# EAGLE design HackmodWear_workingcopy3 (EAGLE 9.1.0)
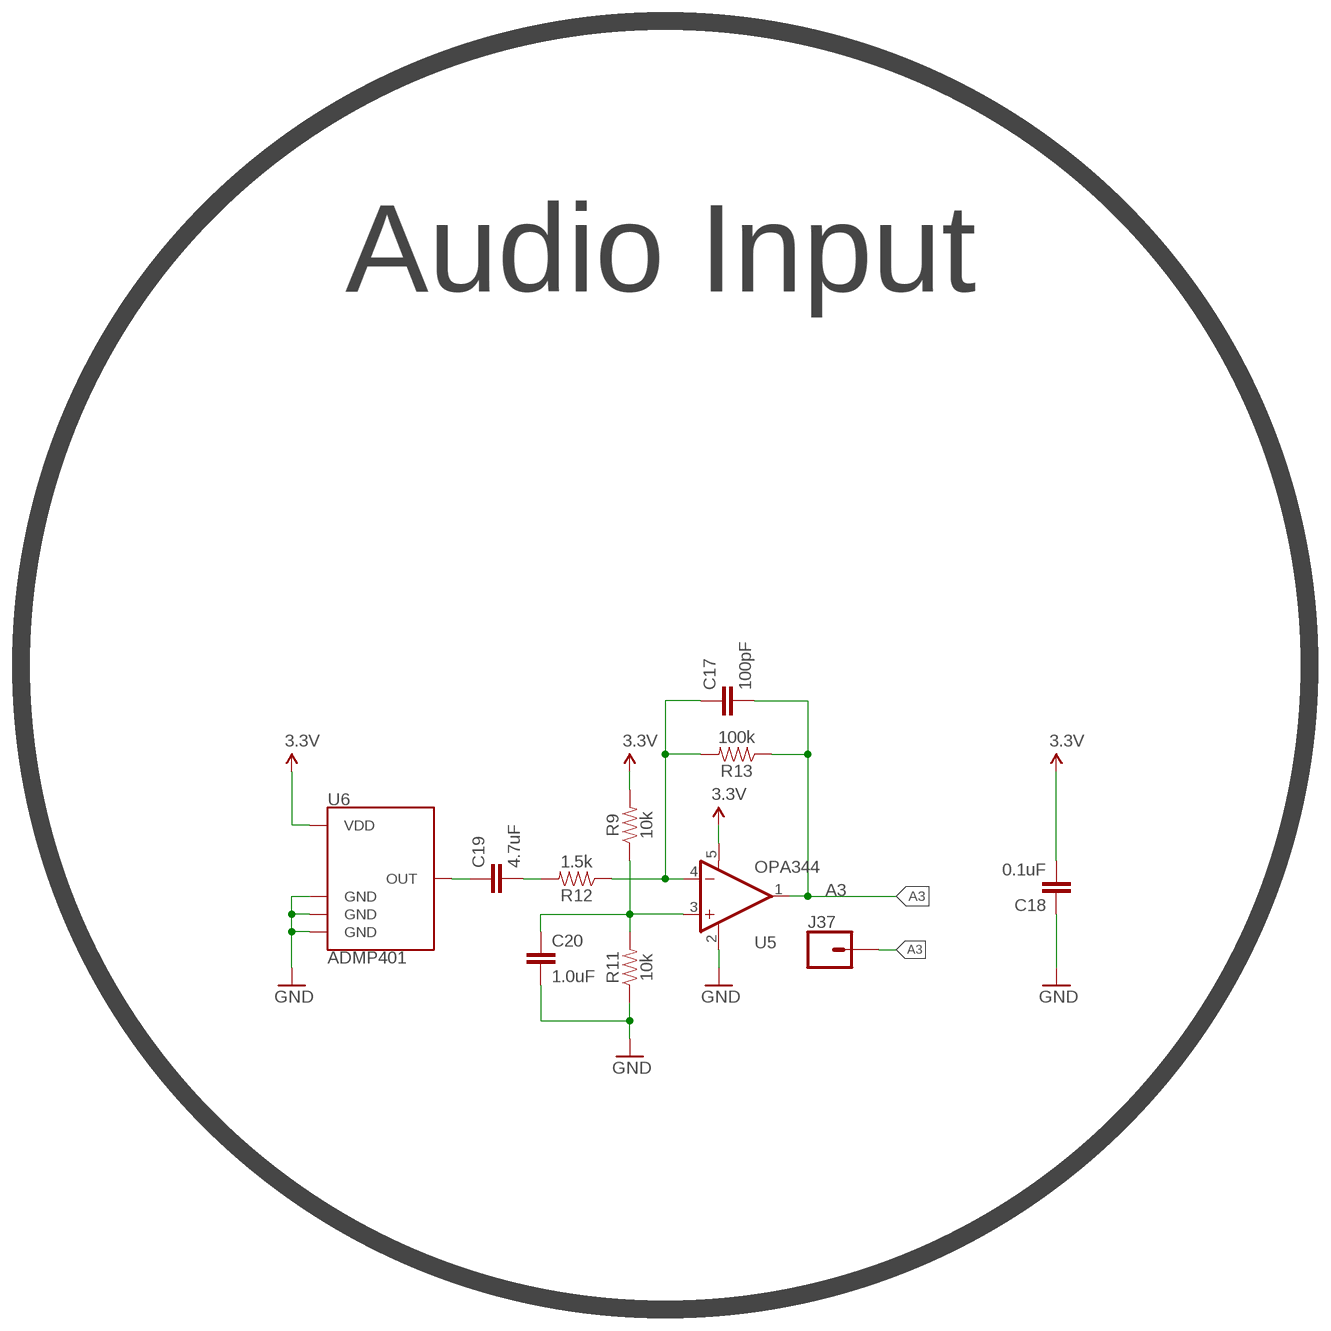
[diagram p0: schematic, sheet 1, part 1 of 3]
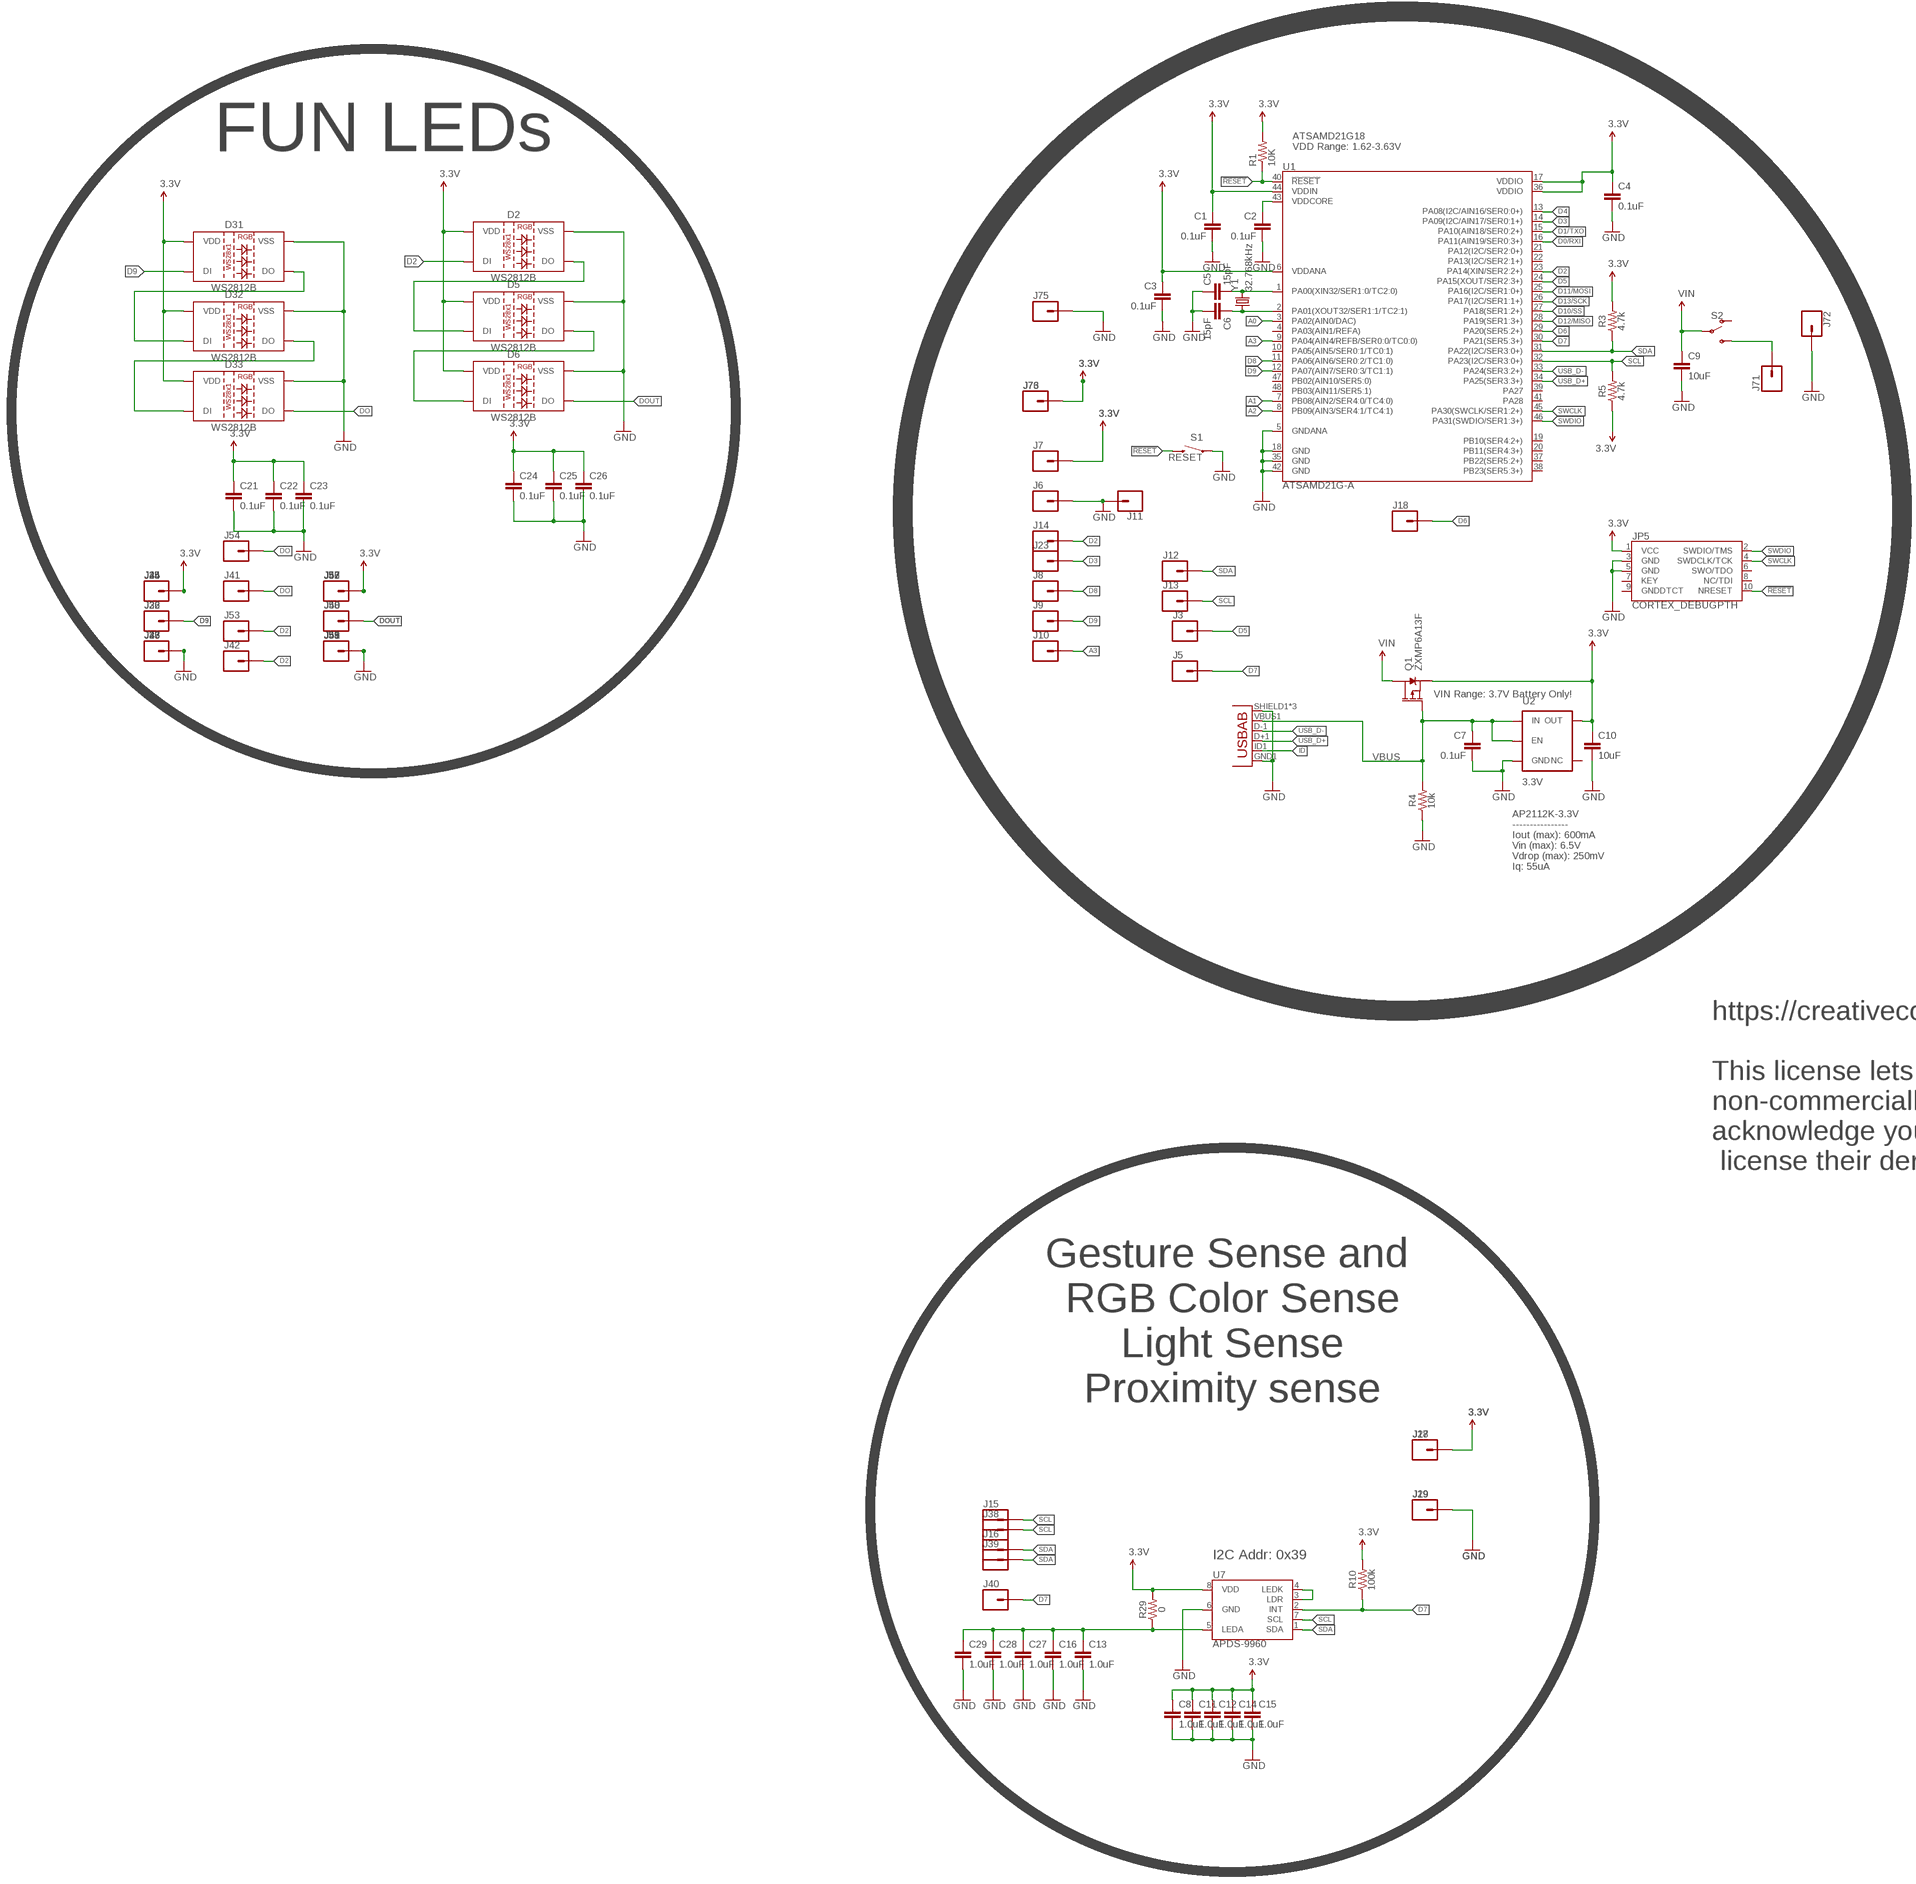
[diagram p1: schematic, sheet 1, part 2 of 3]
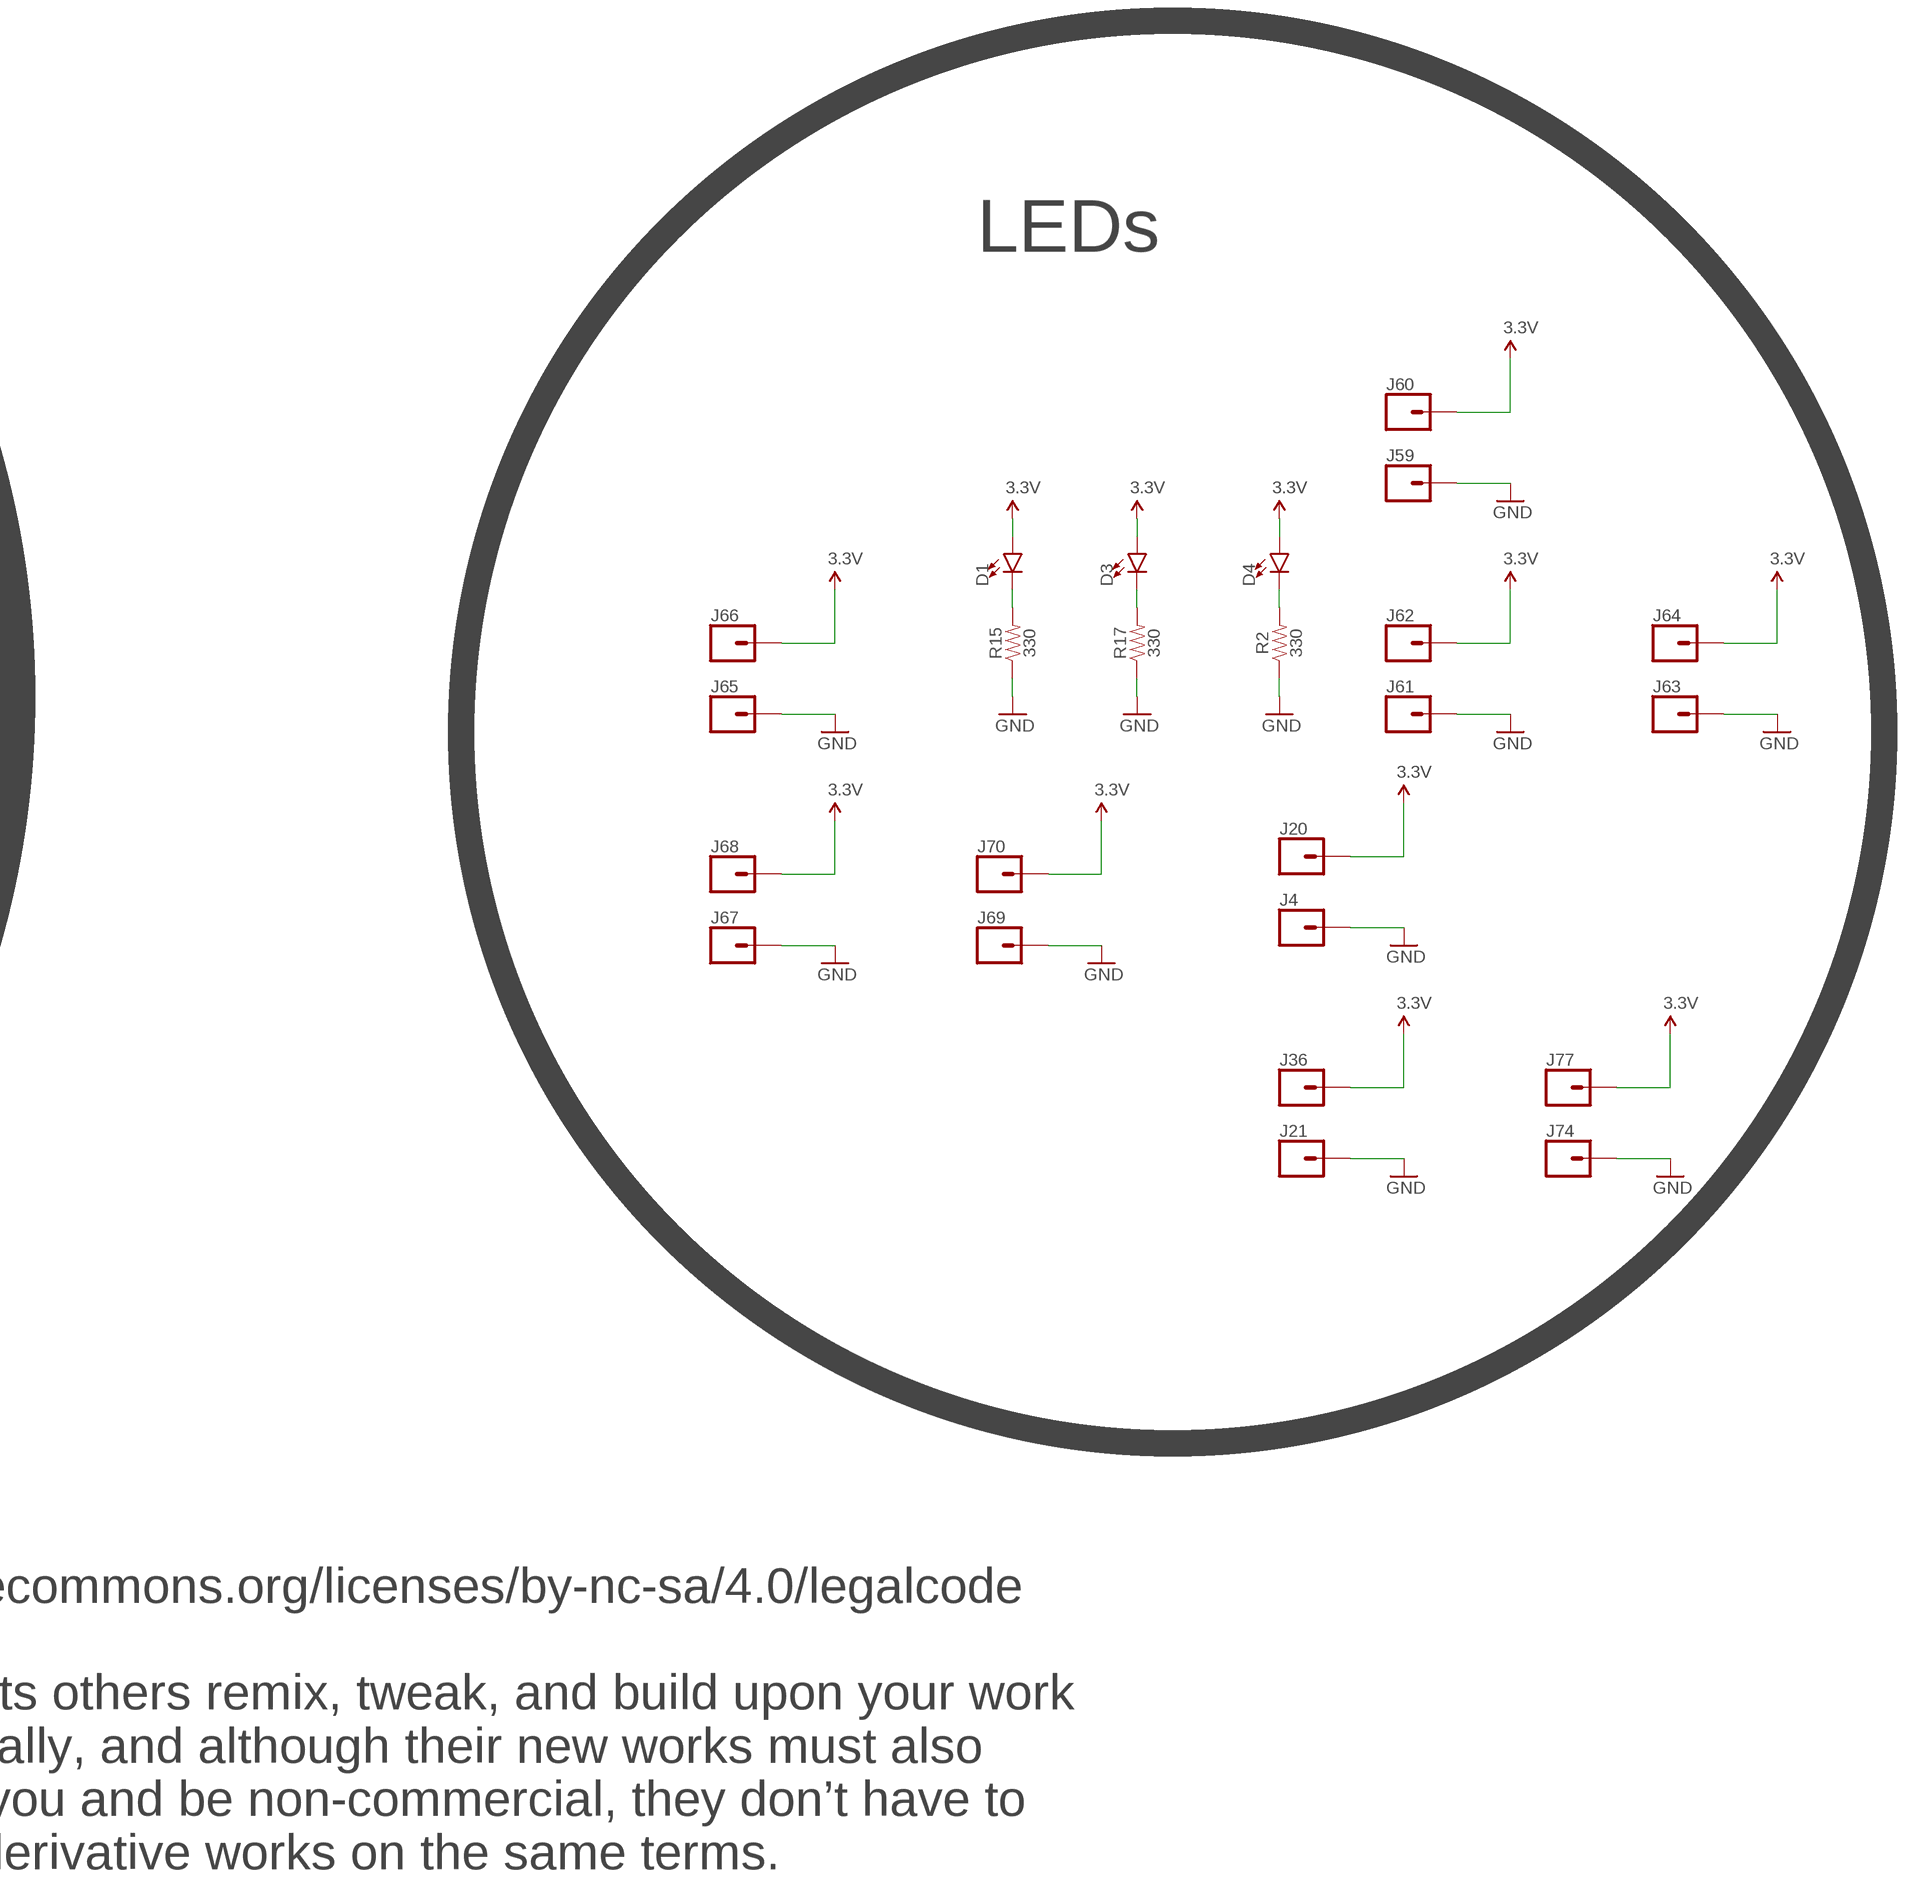
[diagram p2: schematic, sheet 1, part 3 of 3]

## Parts
C1  0.1uF  0.1UF-0603-25V-(+80/-20%)  [0603]
C2  0.1uF  0.1UF-0603-25V-(+80/-20%)  [0603]
C3  0.1uF  0.1UF-0603-25V-(+80/-20%)  [0603]
C4  0.1uF  0.1UF-0603-25V-(+80/-20%)  [0603]
C5  15pF  15PF-0603-50V-5%  [0603]
C6  15pF  15PF-0603-50V-5%  [0603]
C7  0.1uF  0.1UF-0603-25V-(+80/-20%)  [0603]
C8  1.0uF  1.0UF-0603-16V-10%  [0603]
C9  10uF  10UF-0603-6.3V-20%  [0603]
C10  10uF  10UF-0603-6.3V-20%  [0603]
C11  1.0uF  1.0UF-0603-16V-10%  [0603]
C12  1.0uF  1.0UF-0603-16V-10%  [0603]
C13  1.0uF  1.0UF-0603-16V-10%  [0603]
C14  1.0uF  1.0UF-0603-16V-10%  [0603]
C15  1.0uF  1.0UF-0603-16V-10%  [0603]
C16  1.0uF  1.0UF-0603-16V-10%  [0603]
C17  100pF  100PF-0603-50V-5%  [0603]
C18  0.1uF  0.1UF-0603-25V-(+80/-20%)  [0603]
C19  4.7uF  4.7UF0603  [0603]
C20  1.0uF  1.0UF-0603-16V-10%  [0603]
C21  0.1uF  0.1UF-0603-25V-(+80/-20%)  [0603]
C22  0.1uF  0.1UF-0603-25V-(+80/-20%)  [0603]
C23  0.1uF  0.1UF-0603-25V-(+80/-20%)  [0603]
C24  0.1uF  0.1UF-0603-25V-(+80/-20%)  [0603]
C25  0.1uF  0.1UF-0603-25V-(+80/-20%)  [0603]
C26  0.1uF  0.1UF-0603-25V-(+80/-20%)  [0603]
C27  1.0uF  1.0UF-0603-16V-10%  [0603]
C28  1.0uF  1.0UF-0603-16V-10%  [0603]
C29  1.0uF  1.0UF-0603-16V-10%  [0603]
D1  LED1206  [LED-1206]
D2  WS2812B  [WS2812B]
D3  LED1206  [LED-1206]
D4  LED1206  [LED-1206]
D5  WS2812B  [WS2812B]
D6  WS2812B  [WS2812B]
D31  WS2812B  [WS2812B]
D32  WS2812B  [WS2812B]
D33  WS2812B  [WS2812B]
J3  CONN_01  [1X01]
J4  CONN_01  [1X01]
J5  CONN_01  [1X01]
J6  CONN_01  [1X01]
J7  CONN_01  [1X01]
J8  CONN_01  [1X01]
J9  CONN_01  [1X01]
J10  CONN_01  [1X01]
J11  CONN_01  [1X01]
J12  CONN_01  [1X01]
J13  CONN_01  [1X01]
J14  CONN_01  [1X01]
J15  CONN_01  [1X01]
J16  CONN_01  [1X01]
J17  CONN_01  [1X01]
J18  CONN_01  [1X01]
J19  CONN_01  [1X01]
J20  CONN_01  [1X01]
J21  CONN_01  [1X01]
J23  CONN_01  [1X01]
J25  CONN_01  [1X01]
J26  CONN_01  [1X01]
J27  CONN_01  [1X01]
J28  CONN_01  [1X01]
J29  CONN_01  [1X01]
J32  CONN_01  [1X01]
J33  CONN_01  [1X01]
J34  CONN_01  [1X01]
J36  CONN_01  [1X01]
J37  CONN_01  [1X01]
J38  CONN_01  [1X01]
J39  CONN_01  [1X01]
J40  CONN_01  [1X01]
J41  CONN_01  [1X01]
J42  CONN_01  [1X01]
J43  CONN_01  [1X01]
J44  CONN_01  [1X01]
J45  CONN_01  [1X01]
J46  CONN_01  [1X01]
J47  CONN_01  [1X01]
J48  CONN_01  [1X01]
J49  CONN_01  [1X01]
J50  CONN_01  [1X01]
J51  CONN_01  [1X01]
J52  CONN_01  [1X01]
J53  CONN_01  [1X01]
J54  CONN_01  [1X01]
J55  CONN_01  [1X01]
J56  CONN_01  [1X01]
J57  CONN_01  [1X01]
J58  CONN_01  [1X01]
J59  CONN_01  [1X01]
J60  CONN_01  [1X01]
J61  CONN_01  [1X01]
J62  CONN_01  [1X01]
J63  CONN_01  [1X01]
J64  CONN_01  [1X01]
J65  CONN_01  [1X01]
J66  CONN_01  [1X01]
J67  CONN_01  [1X01]
J68  CONN_01  [1X01]
J69  CONN_01  [1X01]
J70  CONN_01  [1X01]
J71  CONN_01  [1X01]
J72  CONN_01  [1X01]
J73  CONN_01  [1X01]
J74  CONN_01  [1X01]
J75  CONN_01  [1X01]
J76  CONN_01  [1X01]
J77  CONN_01  [1X01]
JP3  USB-ABCONN-11794  [USB-AB-MICRO-SMD_V03]
JP5  CORTEX_DEBUGPTH  [2X5-PTH-1.27MM]
Q1  ZXMP6A13F  MOSFET_PCH-SI2309DS  [SOT23-3]
R1  10K  10KOHM-1/10W-1%(0603)0603  [0603-RES@1]
R2  330  330OHM-0603-1/10W-1%  [0603]
R3  4.7k  4.7KOHM-0603-1/10W-1%  [0603]
R4  10k  10KOHM-0603-1/10W-1%  [0603]
R5  4.7k  4.7KOHM-0603-1/10W-1%  [0603]
R9  10k  10KOHM-0603-1/10W-1%  [0603]
R10  100k  100KOHM-0603-1/10W-1%  [0603]
R11  10k  10KOHM-0603-1/10W-1%  [0603]
R12  1.5k  1.5KOHM-0603-1/10W-1%  [0603]
R13  100k  100KOHM-0603-1/10W-1%  [0603]
R15  330  330OHM-0603-1/10W-1%  [0603]
R17  330  330OHM-0603-1/10W-1%  [0603]
R29  0  0OHM-0603-1/10W-5%  [0603]
S1  RESET  SWITCH-MOMENTARY-2SMD-4.6X2.8MM  [TACTILE_SWITCH_SMD_4.6X2.8MM]
S2  SWITCH-SPDT-SMD-RIGHT-ANGLE  [SWITCH_SPST_SMD_A]
U1  ATSAMD21G-A  [TQFP-48]
U2  3.3V  V_REG_AP2112K-3.3V  [SOT23-5]
U5  OPA344  [SOT23-5]
U6  ADMP401  [ADMP401]
U7  APDS-9960  [APDS-9960]
Y1  32.768kHz  CRYSTAL3.2X1.5MM  [CRYSTAL-SMD-3.2X1.5MM]

## Nets
3.3V: C1.1 C4.1 C8.1 C10.1 C11.1 C12.1 C14.1 C15.1 C18.2 C21.1 C22.1 C23.1 C24.1 C25.1 C26.1 D1.A D2.1(VDD) D3.A D4.A D5.1(VDD) D6.1(VDD) D31.1(VDD) D32.1(VDD) D33.1(VDD) J7.P$1 J17.P$1 J20.P$1 J25.P$1 J28.P$1 J34.P$1 J36.P$1 J44.P$1 J45.P$1 J47.P$1 J52.P$1 J56.P$1 J57.P$1 J60.P$1 J62.P$1 J64.P$1 J66.P$1 J68.P$1 J70.P$1 J73.P$1 J76.P$1 J77.P$1 JP5.1(VCC) Q1.2(S) R1.2 R3.2 R5.1 R9.2 R10.2 R29.2 U1.17(VDDIO) U1.36(VDDIO) U1.44(VDDIN) U2.5(OUT) U5.5(V+) U6.5(VDD) U7.8(VDD)
!RESET: JP5.10(NRESET) R1.1 S1.3 S1.4 U1.40(!RESET!)
A0: U1.3(PA02(AIN0/DAC))
A1: U1.7(PB08(AIN2/SER4:0/TC4:0))
A2: U1.8(PB09(AIN3/SER4:1/TC4:1))
A3: C17.2 J10.P$1 J37.P$1 R13.1 U1.9(PA04(AIN4/REFB/SER0:0/TC0:0)) U5.1(OUT)
D0/RXI: U1.16(PA11(AIN19/SER0:3+))
D1/TXO: U1.15(PA10(AIN18/SER0:2+))
D2: D2.4(DI) J14.P$1 J42.P$1 J53.P$1 U1.23(PA14(XIN/SER2:2+))
D3: J23.P$1 U1.14(PA09(I2C/AIN17/SER0:1+))
D4: U1.13(PA08(I2C/AIN16/SER0:0+))
D5: J3.P$1 U1.24(PA15(XOUT/SER2:3+))
D6: J18.P$1 U1.29(PA20(SER5:2+))
D7: J5.P$1 J40.P$1 R10.1 U1.30(PA21(SER5:3+)) U7.2(INT)
D8: J8.P$1 U1.11(PA06(AIN6/SER0:2/TC1:0))
D9: D31.4(DI) J9.P$1 J26.P$1 J32.P$1 U1.12(PA07(AIN7/SER0:3/TC1:1))
D10/SS: U1.27(PA18(SER1:2+))
D11/MOSI: U1.25(PA16(I2C/SER1:0+))
D12/MISO: U1.28(PA19(SER1:3+))
D13/SCK: U1.26(PA17(I2C/SER1:1+))
DO: D33.2(DO) J41.P$1 J54.P$1
DOUT: D6.2(DO) J48.P$1 J50.P$1
GND: C1.2 C2.2 C3.2 C4.2 C5.1 C6.2 C7.2 C8.2 C9.2 C10.2 C11.2 C12.2 C13.2 C14.2 C15.2 C16.2 C18.1 C20.2 C21.2 C22.2 C23.2 C24.2 C25.2 C26.2 C27.2 C28.2 C29.2 D2.3(VSS) D5.3(VSS) D6.3(VSS) D31.3(VSS) D32.3(VSS) D33.3(VSS) J4.P$1 J6.P$1 J11.P$1 J19.P$1 J21.P$1 J27.P$1 J29.P$1 J33.P$1 J43.P$1 J46.P$1 J49.P$1 J51.P$1 J55.P$1 J58.P$1 J59.P$1 J61.P$1 J63.P$1 J65.P$1 J67.P$1 J69.P$1 J72.P$1 J74.P$1 J75.P$1 JP3.GND1(GND) JP3.SHIELD1(SHIELD) JP3.SHIELD2(SHIELD) JP3.SHIELD3(SHIELD) JP5.3(GND) JP5.5(GND) R2.1 R4.1 R11.1 R15.1 R17.1 S1.1 S1.2 U1.5(GNDANA) U1.18(GND) U1.35(GND) U1.42(GND) U2.2(GND) U5.2(V-) U6.2(GND) U6.4(GND) U6.6(GND) U7.6(GND)
ID: JP3.ID1(USBID)
LEDA: C13.1 C16.1 C27.1 C28.1 C29.1 R29.1 U7.5(LEDA)
N$1: D4.C R2.2
N$2: C5.2 U1.1(PA00(XIN32/SER1:0/TC2:0)) Y1.P$2
N$3: C19.1 U6.1(OUT)
N$4: C6.1 U1.2(PA01(XOUT32/SER1:1/TC2:1)) Y1.P$1
N$5: U7.3(LDR) U7.4(LEDK)
N$6: C17.1 R12.1 R13.2 U5.4(-IN)
N$10: C19.2 R12.2
N$11: C20.1 R9.1 R11.2 U5.3(+IN)
N$12: D1.C R15.2
N$14: D31.2(DO) D32.4(DI)
N$15: D3.C R17.2
N$16: D32.2(DO) D33.4(DI)
N$21: J71.P$1 S2.3(S)
N$22: D2.2(DO) D5.4(DI)
N$23: D5.2(DO) D6.4(DI)
SCL: J13.P$1 J15.P$1 J38.P$1 R5.2 U1.32(PA23(I2C/SER3:0+)) U7.7(SCL)
SDA: J12.P$1 J16.P$1 J39.P$1 R3.1 U1.31(PA22(I2C/SER3:0+)) U7.1(SDA)
SWCLK: JP5.4(SWDCLK/TCK) U1.45(PA30(SWCLK/SER1:2+))
SWDIO: JP5.2(SWDIO/TMS) U1.46(PA31(SWDIO/SER1:3+))
USB_D+: JP3.D+1(D+) U1.34(PA25(SER3:3+))
USB_D-: JP3.D-1(D-) U1.33(PA24(SER3:2+))
VBUS: C7.1 JP3.VBUS1(VBUS) Q1.1(G) R4.2 U2.1(IN) U2.3(EN)
VDDANA: C3.1 U1.6(VDDANA) ; supply symbol labelled 3.3V
VDDCORE: C2.1 U1.43(VDDCORE)
VIN: C9.1 Q1.3(D) S2.2(P)
Unconnected: JP5.6(SWO/TDO) JP5.7(KEY) JP5.8(NC/TDI) JP5.9(GNDDTCT) S2.1(O) U1.4(PA03(AIN1/REFA)) U1.10(PA05(AIN5/SER0:1/TC0:1)) U1.19(PB10(SER4:2+)) U1.20(PB11(SER4:3+)) U1.21(PA12(I2C/SER2:0+)) U1.22(PA13(I2C/SER2:1+)) U1.37(PB22(SER5:2+)) U1.38(PB23(SER5:3+)) U1.39(PA27) U1.41(PA28) U1.47(PB02(AIN10/SER5:0)) U1.48(PB03(AIN11/SER5:1)) U2.4(NC)

## Notes on the sheet
- Audio Input
- ATSAMD21G18
  VDD Range: 1.62-3.63V
- FUN LEDs
- LEDs
- VIN Range: 3.7V Battery Only!
- AP2112K-3.3V
  ----------------
  Iout (max): 600mA 
  Vin (max): 6.5V
  Vdrop (max): 250mV
  Iq: 55uA
- https://creativecommons.org/licenses/by-nc-sa/4.0/legalcode
  
  This license lets others remix, tweak, and build upon your work
  non-commercially, and although their new works must also 
  acknowledge you and be non-commercial, they don’t have to
   license their derivative works on the same terms.
- Gesture Sense and 
  RGB Color Sense
  Light Sense
  Proximity sense
- I2C Addr: 0x39

## Library data of the parts
C1-C4 C7 C18 C21-C26 = SparkFun-Capacitors:0.1UF: 0.1µF ceramic capacitors A capacitor is a passive two-terminal electrical component used to store electrical energy temporarily in an electric field.; PROD_ID: CAP-00810
C5 C6 = SparkFun-Capacitors:15PF: 15pF ceramic capacitors A capacitor is a passive two-terminal electrical component used to store electrical energy temporarily in an electric field.; PROD_ID: CAP-07881
C8 C11-C16 C20 C27-C29 = SparkFun-Capacitors:1.0UF: 1µF ceramic capacitors A capacitor is a passive two-terminal electrical component used to store electrical energy temporarily in an electric field.; PROD_ID: CAP-00868
C9 C10 = SparkFun-Capacitors:10UF: 10.0µF ceramic capacitors A capacitor is a passive two-terminal electrical component used to store electrical energy temporarily in an electric field.; PROD_ID: CAP-11015
C17 = SparkFun-Capacitors:100PF: 100pF/0.1nF ceramic capacitors A capacitor is a passive two-terminal electrical component used to store electrical energy temporarily in an electric field.; PROD_ID: CAP-07883
C19 = SparkFun-Capacitors:4.7UF: 4.7µF ceramic capacitors A capacitor is a passive two-terminal electrical component used to store electrical energy temporarily in an electric field.; PROD_ID: CAP-08280
D1 D3 D4 = SparkFun-LED:LED: LED (Generic) Standard schematic elements and footprints for 5mm, 3mm, 1206, and 0603 sized LEDs. Generic LEDs with no color specified.
D2 D5 D6 D31-D33 = SparkFun-LED:WS2812B: WS2812B SMD addressable RGB LED 5x5mm SMD LED with built-in controller IC. Color: Red/Green/Blue mC Rating: RGB: 390, 660, 180 mcd Forward Voltage: RGB: 2.0, 3.0, 3.0 V Packages:WS2812B SparkFun Products: Blynk Board - ESP8266 <https://www.sparkfun.com/products/13794>; PROD_ID: DIO-12503
J3-J21 J23 J25-J29 J32-J34 J36-J77 = SparkFun-Connectors:CONN_01: Single connection point. Often used as Generic Header-pin footprint for 0.1 inch spaced/style header connections On any of the 0.1 inch spaced packages, you can populate with these: Break Away Headers - Straight (PRT-00116) Break Away Male Headers - Right Angle (PRT-00553) Female Headers (PRT-00115) Break Away Headers - Machine Pin (PRT-00117) Break Away Female Headers - Swiss Machine Pin (PRT-00743) This device is also useful as a general connection point to wire up your design to another part of your project. Our various solder wires solder well into these plated through hole pads. Hook-Up Wire - Assortment (Stranded, 22 AWG) (PRT-11375) Hook-Up Wire - Assortment (Solid Core, 22 AWG) (PRT-11367) View the entire wire category on our website here Special notes: SMTSO-256-ET is a "flush mount" nut for a 4-40 screw. We mostly use this on specialty testbeds; it is a nice way to connect hardware to your PCB at an adjustable hieght. Also note, the SNAP packages are for using a snappable style connector. We sell a baggie of snaps and they are also used on two LilyPad designs: Snap Assortment - 30 pack (male and female) (DEV-11347) LilyPad Arduino SimpleSnap (DEV-10941) LilyPad SimpleSnap Protoboard (DEV-10940)
JP3 = SparkFun-Connectors:USB-AB: This is a USB AB connector that is compatible with USB OTG. i.e. this connector can serve as a host or device; PROD_ID: CONN-11794
JP5 = samd21-temp:CORTEX_DEBUG: Cortex Debug Connector Datasheet
Q1 = SparkFun-DiscreteSemi:MOSFET_PCH: P-channel MOSFETs Voltage controlled devices that allow control of high current outputs. SparkFun Products: SparkFun ESP32 Thing <https://www.sparkfun.com/products/13907> SparkFun ESP8266 Thing <https://www.sparkfun.com/products/13231>; PROD_ID: TRANS-08285; VALUE: 1.1A/60V/600mΩ
R1 = SparkFun-Resistors:10KOHM-1/10W-1%(0603): RES-00824; PROD_ID: RES-00824
R2 R15 R17 = SparkFun-Resistors:330OHM: 330Ω resistor A resistor is a passive two-terminal electrical component that implements electrical resistance as a circuit element. Resistors act to reduce current flow, and, at the same time, act to lower voltage levels within circuits. - Wikipedia; PROD_ID: RES-00818
R3 R5 = SparkFun-Resistors:4.7KOHM: 4.7kΩ resistor A resistor is a passive two-terminal electrical component that implements electrical resistance as a circuit element. Resistors act to reduce current flow, and, at the same time, act to lower voltage levels within circuits. - Wikipedia; PROD_ID: RES-07857
R4 R9 R11 = SparkFun-Resistors:10KOHM: 10kΩ resistor A resistor is a passive two-terminal electrical component that implements electrical resistance as a circuit element. Resistors act to reduce current flow, and, at the same time, act to lower voltage levels within circuits. - Wikipedia; PROD_ID: RES-00824
R10 R13 = SparkFun-Resistors:100KOHM: 100kΩ resistor A resistor is a passive two-terminal electrical component that implements electrical resistance as a circuit element. Resistors act to reduce current flow, and, at the same time, act to lower voltage levels within circuits. - Wikipedia; PROD_ID: RES-07828
R12 = SparkFun-Resistors:1.5KOHM: 1.5kΩ resistor A resistor is a passive two-terminal electrical component that implements electrical resistance as a circuit element. Resistors act to reduce current flow, and, at the same time, act to lower voltage levels within circuits. - Wikipedia; PROD_ID: RES-08306
R29 = SparkFun-Resistors:0OHM: 0Ω resistor A resistor is a passive two-terminal electrical component that implements electrical resistance as a circuit element. Resistors act to reduce current flow, and, at the same time, act to lower voltage levels within circuits. - Wikipedia; PROD_ID: RES-08609
S1 = samd21-temp:SWITCH-MOMENTARY-2: Various NO switches- pushbuttons, reed, etc; PROD_ID: SWCH-13065
S2 = SparkFun-Switches:SWITCH-SPDT: Single Pole, Double Throw (SPDT) Switch Single-pole, double-throw (SPDT) switch. Variant Overview SMD-AYZ0202 Surface Mount DPDT Switch (COM-00597) Used on e.g. LilyPad Arduino USB - ATmega32U4 Board PTH-11.6X4.0MM SPDT Mini Power Switch (COM-00102) Used on e.g. SparkFun Simon Says - Through-Hole Soldering Kit (KIT-10547) PTH-11.6X4.0MM-KIT KIT version of SPDT Mini Power Switch - Simplifies soldering by removing tStop of switch pins - only one side can be soldered. PTH-11.6X4.0MM-LOCK LOCK version of SPDT Mini Power Switch - Offset pins hold switch in place for easier soldering. SMD-RIGHT-ANGLE Surface Mount Right Angle Switch (COM-10860) Used on e.g. SparkFun ESP8266 Thing; PROD_ID: SWCH-10651; SF_SKU: COM-10860
U1 = samd21-temp:ATSAMD21G: Atmel SAMD21G SMART ARM-Based Microcontroller The Atmel ® | SMART ™ SAM D21 is a series of low-power microcontrollers using the 32-bit ARM ® Cortex ® -M0+ processor, and ranging from 32- to 64-pins with up to 256KB Flash and 32KB of SRAM. The SAM D21 devices operate at a maximum frequency of 48MHz and reach 2.46 CoreMark/MHz. They are designed for simple and intuitive migration with identical peripheral modules, hex compatible code, identical linear address map and pin compatible migration paths between all devices in the product series. All devices include intelligent and flexible peripherals, Atmel Event System for inter-peripheral signaling, and support for capacitive touch button, slider and wheel user interfaces.; PROD_ID: IC-13064
U2 = SparkFun-PowerIC:V_REG_AP2112: AP2112 - 600mA CMOS LDO Regulator w/ Enable The AP2112 is CMOS process low dropout linear regulator with enable function, the regulator delivers a guaranteed 600mA (min.) continuous load current. Features Output Voltage Accuracy: ±1.5% Output Current: 600mA (Min.) Foldback Short Current Protection: 50mA Enable Function to Turn ON/OFF VOUT Low Dropout Voltage (3.3V): 250mV (Typ.) @IOUT=600mA Excellent Load Regulation: 0.2%/A (Typ.) Excellent Line Regulation: 0.02%/V (Typ.) Low Quiescent Current: 55μA (Typ.) Low Standby Current: 0.01μA (Typ.) Low Output Noise: 50μVRMS PSRR: 100Hz -65dB, 1kHz -65dB OTSD Protection Stable with 1.0μF Flexible Cap: Ceramic, Tantalum and Aluminum Electrolytic Operation Temperature Range: -40°C to 85°C ESD: MM 400V, HBM 4000V; PROD_ID: VREG-12457
U5 = SparkFun:OPA344
U6 = SparkFun-Sensors:ADMP401: ADMP401 - Omnidirection Bottom-Port MEMS Microphone The ADMP401 is a high quality, low cost, low power analog output bottom-ported omnidirectional MEMS microphone. The ADMP401 consists of a MEMS microphone element, an impedance converter, and an output amplifier. The ADMP401 sensitivity specification makes it an excellent choice for both near field and far field applications. Datasheet SparkFun Products SparkFun MEMS Microphone Breakout - INMP401 (ADMP401) (BOB-09868) MEMS Microphone - INMP401 (ADMP401) (COM-10028); PROD_ID: IC-09773
U7 = SparkFun-Sensors:APDS-9960: Avago APDS-9960 Digital Proximity, Ambient Light, RGB, and Gesture Sensor. The APDS-9960 offers ambient light and color measuring, proximity detection, and touchless gesture sensing. It features UV and IR blocking filters, four separate diodes sensitive to different directions, and an I2C compatible interface. Datasheet SparkFun Products SparkFun RGB and Gesture Sensor - APDS-9960 (SEN-12787); PROD_ID: SEN-12005
Y1 = samd21-temp:CRYSTAL: Various standard crystals. Proven footprints.; PROD_ID: XTAL-13062

## Board
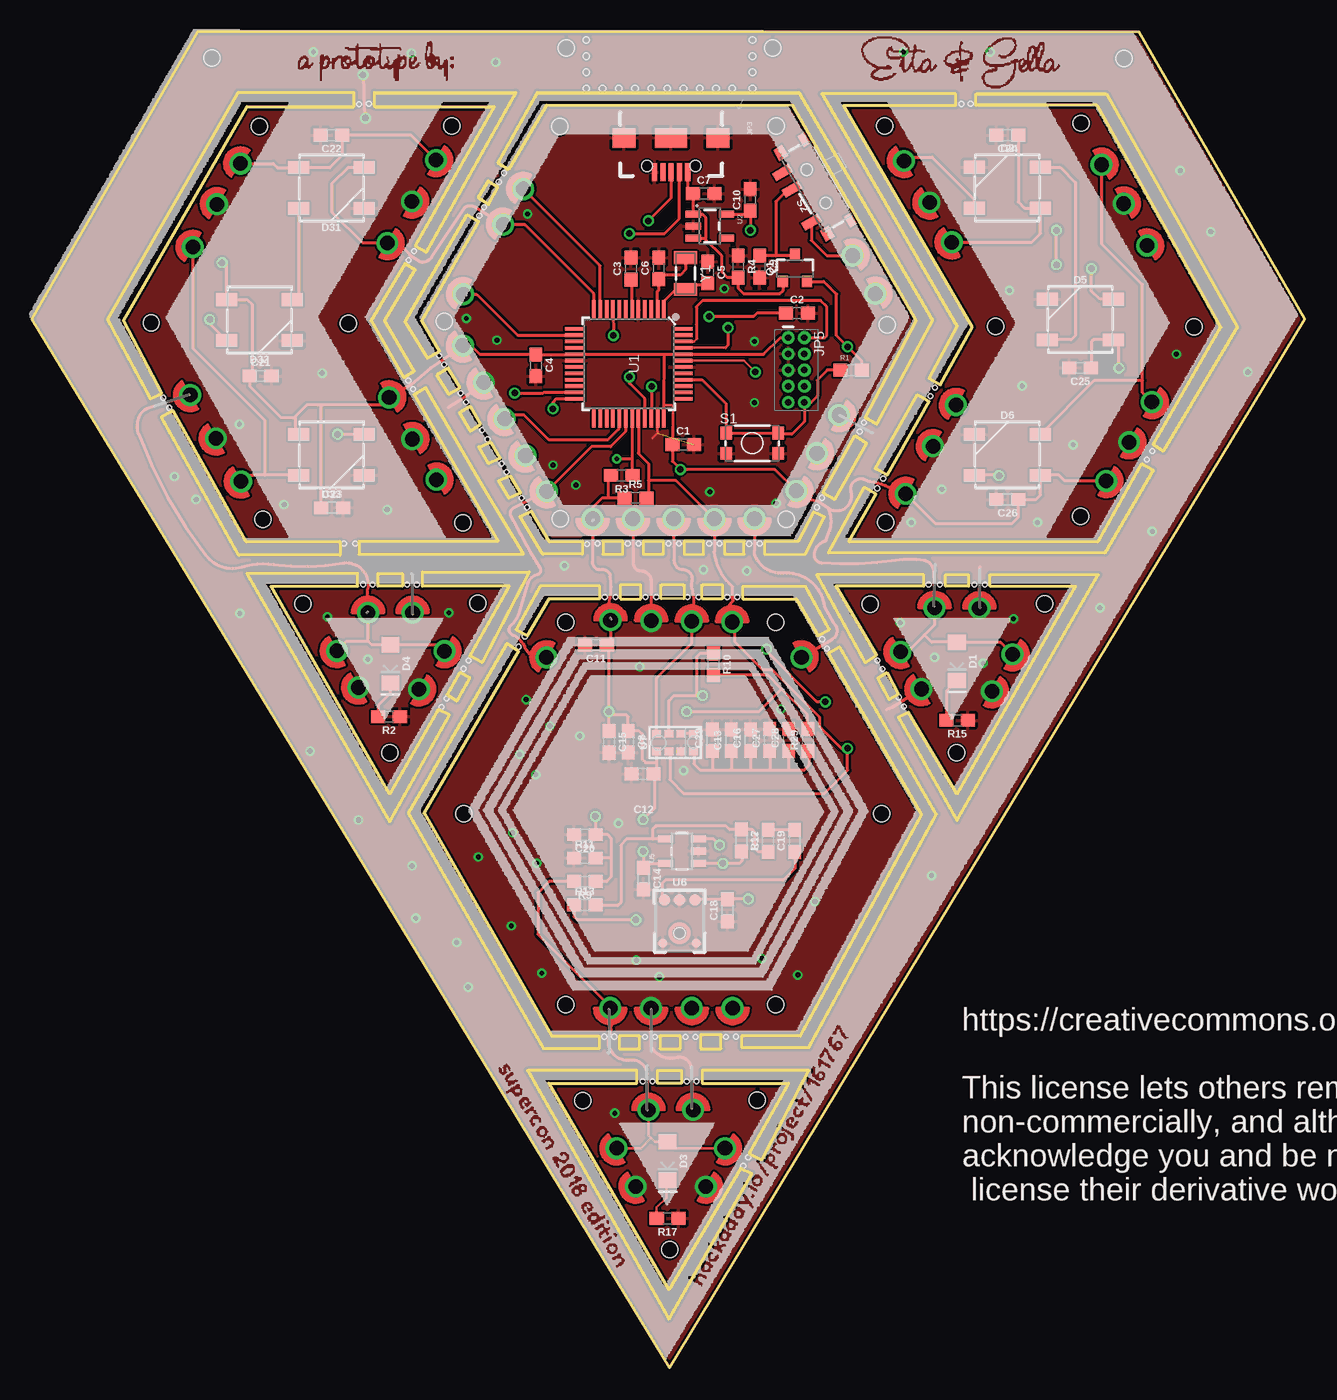
[diagram p3: board, top side]
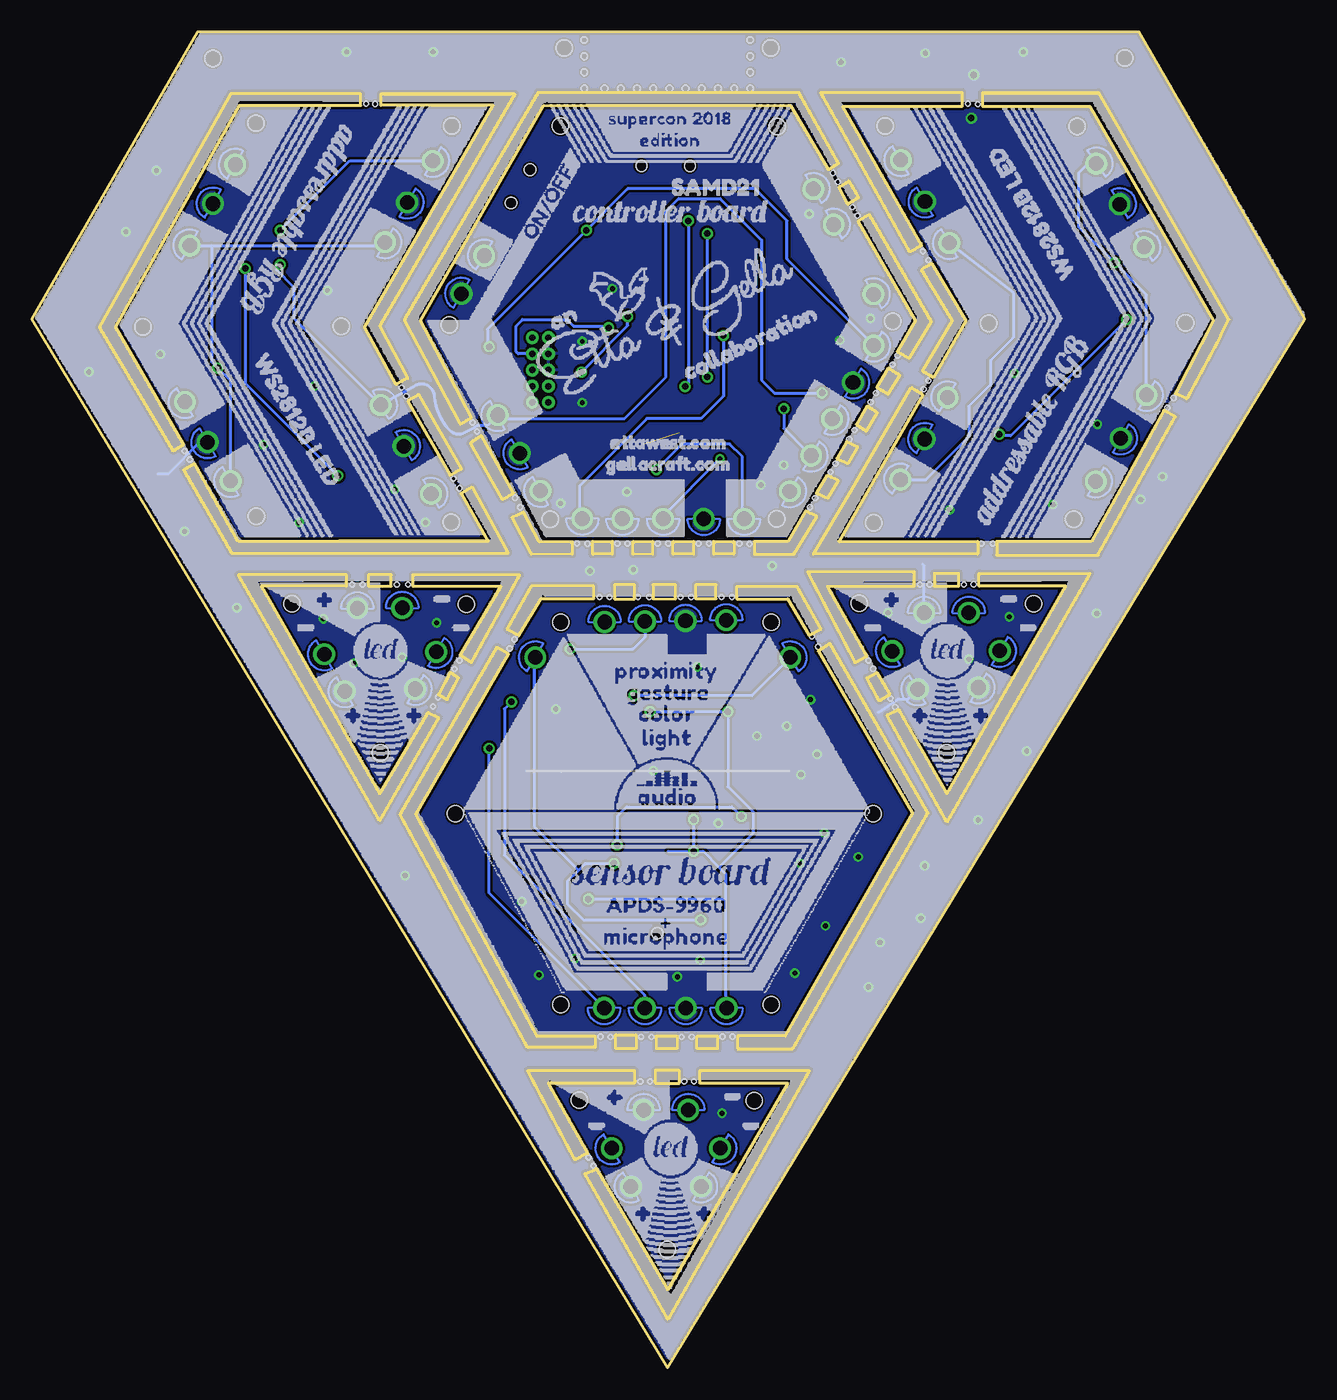
[diagram p4: board, bottom side, seen from below]

Size 99.85 x 104.77 mm. Coordinates in mm from the lower left corner, seen from the top.
Outline: 251 segments
Copper layers (1*16): Top 0.035mm / dielectric 1.5mm / Bottom 0.035mm
Design rules "SparkFun-2-layer-TIGHT": minimum track width 7mil, minimum drill 15mil, track to track 7mil, track to pad 7mil, pad to pad 7mil, via to via 7mil, smd to smd 7mil, copper to edge 7mil, drill to drill 7mil, minimum pad ring 7mil, minimum via ring 7mil, stop-mask expansion 4mil, vias tented up to drill 25mil, thermal gap 10mil
Holes 1.27 mm at 33.82,66.28 32.93,97.39 41.87,28.46 66.65,43.43 59.18,66.54 21.27,59.91 28.09,48.22 41.91,103.5 58.37,28.46 34.97,59.95 85.66,102.68 66.91,97.38 66.97,66.32 82.3,97.61 41.87,58.46 58.37,58.46 41.45,66.56 32.35,82.06 41.39,97.37 9.36,81.96 17.86,97.37 18.12,66.53 75.59,81.68 82.25,66.77 58.1,103.5 24.81,81.9 14.12,102.72 33.87,43.46 58.39,97.39 67.1,81.81 91.16,81.62 65.76,59.89 72.53,48.23 79.46,59.93 43.21,20.93 50.03,9.24 56.91,20.97
Holes 0.51 mm at 43.5,100.33 43.5,101.6 43.5,102.87 43.5,104.14 56.52,100.33 56.52,101.6 56.52,102.87 56.52,104.14 48.58,100.33 47.31,100.33 46.04,100.33 44.77,100.33 53.66,100.33 52.39,100.33 51.12,100.33 49.85,100.33 54.93,100.33
Holes 0.38 mm at 25.66,99.11 26.44,99.13 29.54,86.87 29.97,87.58 29.53,77.42 29.9,76.75 31.94,79.38 32.34,78.68 33.64,76.44 34.06,75.72 35.74,72.82 35.32,73.55 36.83,70.92 37.22,70.24 38.41,68.2 38.83,67.49 43.55,64.61 44.37,64.64 46.74,64.64 47.58,64.64 49.94,64.65 50.76,64.64 53.13,64.64 53.93,64.64 56.27,64.62 57.09,64.63 61.99,57.13 62.37,56.4 55.32,60.45 54.54,60.44 52.31,60.44 51.42,60.44 48.97,60.44 48.14,60.44 45.77,60.46 44.93,60.44 25.98,61.44 25.37,64.63 24.47,64.64 26.74,61.43 29.43,61.43 30.2,61.44 38.66,57.36 38.17,56.55 87.87,71.91 87.46,71.22 70.84,76.86 65.27,74.13 70.47,76.21 66.78,69.74 66.31,68.97 35.09,90.36 35.48,91.02 36.63,93.01 37.03,93.71 64.93,73.42 61.57,67.48 61.96,68.23 34.25,55.47 33.86,54.81 32.52,52.48 32.14,51.82 70.35,61.41 71.23,61.41 73.92,61.41 74.75,61.44 68.39,51.86 67.99,52.58 66.7,54.8 66.32,55.46 47.92,22.46 48.68,22.45 51.37,22.45 52.14,22.46 56.19,16.49 55.8,15.83 55.23,25.96 54.45,25.95 52.07,25.96 51.26,25.96 48.88,25.95 48.1,25.95 45.68,25.97 44.9,25.96 72.92,99.12 73.64,99.13 10.3,76.07 10.78,75.28

### Footprints (pad centres in the part's own frame; a part is rotated, then mirrored left to right if it is on the bottom)
0603 = smd 1.1 x 1: 1 -0.85,0; 2 0.85,0
LED-1206 = smd 1.2 x 1.4: A -1.5,0; C 1.5,0
WS2812B = smd 1.651 x 1: 1 2.577,-1.6; 2 2.577,1.6; 3 -2.577,1.6; 4 -2.577,-1.6
1X01 = drill 1.143: P$1 0,0
USB-AB-MICRO-SMD_V03 = smd 1.4 x 0.4: D+1 2.7,0; D-1 2.7,0.65; GND1 2.7,-1.3; ID1 2.7,-0.65; VBUS1 2.7,1.3 | smd 1.5 x 1.8: SHIELD1 0,3.68; SHIELD3 0,-3.68 | smd 1.5 x 2.5: SHIELD2 0,0 | hole 0.85: 2.2,1.9; 2.2,-1.9
2X5-PTH-1.27MM = drill 0.508 pad 1: 1 -2.54,-0.635; 2 -2.54,0.635; 3 -1.27,-0.635; 4 -1.27,0.635; 5 0,-0.635; 6 0,0.635; 7 1.27,-0.635; 8 1.27,0.635; 9 2.54,-0.635; 10 2.54,0.635
SOT23-3 = smd 0.8 x 0.9: 1 -0.95,-1; 2 0.95,-1; 3 0,1.1
0603-RES@1 = smd 1.1 x 1: 1 -0.85,0; 2 0.85,0
TACTILE_SWITCH_SMD_4.6X2.8MM = smd 0.9 x 1: 1 -2.05,-0.8; 2 2.05,-0.8; 3 2.05,0.8; 4 -2.05,0.8
SWITCH_SPST_SMD_A = smd 0.7 x 1.5: 1 -2.25,-1.75; 2 -0.75,-1.75; 3 2.25,-1.75 | smd 1 x 0.6: GND1 -3.65,1; GND3 3.65,1 | smd 1 x 0.8: GND2 -3.65,-1.1; GND4 3.65,-1.1 | hole 0.9: -1.5,0; 1.5,0
TQFP-48 = smd 1.5 x 0.28: 1 -4.25,2.75; 2 -4.25,2.25; 3 -4.25,1.75; 4 -4.25,1.25; 5 -4.25,0.75; 6 -4.25,0.25; 7 -4.25,-0.25; 8 -4.25,-0.75; 9 -4.25,-1.25; 10 -4.25,-1.75; 11 -4.25,-2.25; 12 -4.25,-2.75; 25 4.25,-2.75; 26 4.25,-2.25; 27 4.25,-1.75; 28 4.25,-1.25; 29 4.25,-0.75; 30 4.25,-0.25; 31 4.25,0.25; 32 4.25,0.75; 33 4.25,1.25; 34 4.25,1.75; 35 4.25,2.25; 36 4.25,2.75 | smd 0.28 x 1.5: 13 -2.75,-4.25; 14 -2.25,-4.25; 15 -1.75,-4.25; 16 -1.25,-4.25; 17 -0.75,-4.25; 18 -0.25,-4.25; 19 0.25,-4.25; 20 0.75,-4.25; 21 1.25,-4.25; 22 1.75,-4.25; 23 2.25,-4.25; 24 2.75,-4.25; 37 2.75,4.25; 38 2.25,4.25; 39 1.75,4.25; 40 1.25,4.25; 41 0.75,4.25; 42 0.25,4.25; 43 -0.25,4.25; 44 -0.75,4.25; 45 -1.25,4.25; 46 -1.75,4.25; 47 -2.25,4.25; 48 -2.75,4.25
SOT23-5 = smd 0.55 x 1.2: 1 -0.95,-1.3; 2 0,-1.3; 3 0.95,-1.3; 4 0.95,1.3; 5 -0.95,1.3
ADMP401 = smd 0.9 x 0.9: 1 -1.2,2.62; 5 1.2,2.62; 6 0,2.62 | smd 0.7 x 0.7: 2 1.3,-0.8; 4 -1.3,-0.8 | hole 0.9: 0,0
APDS-9960 = smd 0.6 x 0.72: 1 0.7,1.455; 2 0.7,0.485; 3 0.7,-0.485; 4 0.7,-1.455; 5 -0.7,-1.455; 6 -0.7,-0.485; 7 -0.7,0.485; 8 -0.7,1.455
CRYSTAL-SMD-3.2X1.5MM = smd 1 x 1.8: P$1 -1.25,0; P$2 1.25,0

### Placement (x,y rotation side)
C1  51.08,72.41 0 top
C2  60.01,82.71 0 top
C3  46.99,86.2 90 top
C4  39.53,78.61 270 top
C5  53.02,85.92 270 top
C6  49.17,86.23 90 top
C7  52.71,92.08 0 top
C8  46.78,49.1 270 top
C9  57.09,86.36 270 top
C10  56.36,91.6 90 top
C11  44.24,56.68 180 top
C12  47.9,46.56 180 top
C13  54.87,49.21 90 top
C14  47.98,38.34 270 top
C15  45.26,49.08 270 top
C16  56.39,49.22 90 top
C17  55.66,41.35 270 top
C18  54.56,35.86 90 top
C19  59.84,41.31 90 top
C20  43.38,41.8 180 top
C21  17.94,77.79 0 top
C22  23.49,96.68 180 top
C23  23.55,67.45 0 top
C24  76.52,96.68 180 top
C25  82.23,78.42 180 top
C26  76.52,68.1 180 top
C27  57.89,49.23 90 top
C28  59.38,49.23 90 top
C29  53.39,49.21 90 top
D1  72.56,55.4 270 top
D2  76.52,92.55 0 top
D3  49.87,16.21 270 top
D4  28.11,55.21 270 top
D5  82.24,82.22 0 top
D6  76.52,71.6 0 top
D31  23.5,92.53 180 top
D32  17.85,82.17 180 top
D33  23.49,71.6 180 top
J3  38.72,71.54 120 top
J4  29.86,59.21 0 top
J5  40.4,68.74 120 top
J6  35.45,77.27 120 top
J7  68.54,68.54 60 top
J8  38.55,92.45 60 top
J9  36.96,89.65 60 top
J10  56.68,66.59 180 top
J11  47.15,66.57 180 top
J12  50.34,66.58 180 top
J13  54.97,28.21 180 top
J14  63.32,74.71 243 top
J15  54.93,58.48 0 top
J16  51.76,58.53 0 top
J17  45.39,58.62 0 top
J18  37.08,74.42 120 top
J19  48.58,58.57 0 top
J20  26.36,59.21 0 top
J21  25.61,53.35 120 top
J23  33.84,84.19 60 top
J25  31.7,94.72 240 top
J26  31.72,69.65 300 top
J27  14.53,91.26 60 top
J28  45.37,28.21 180 top
J29  48.57,28.21 180 top
J32  27.89,88.21 240 top
J33  29.83,72.83 300 top
J34  28.02,76.1 300 top
J36  32.37,56.21 240 top
J37  60.37,55.71 300 top
J38  53.54,66.57 180 top
J39  51.77,28.21 180 top
J40  40.37,55.71 60 top
J41  16.41,69.51 120 top
J42  72.49,75.5 60 top
J43  29.81,91.47 240 top
J44  16.36,94.44 55 top
J45  12.42,76.3 120 top
J46  14.44,72.89 120 top
J47  72.16,88.27 120 top
J48  83.9,94.35 300 top
J49  85.65,91.3 300 top
J50  87.85,75.74 240 top
J51  70.41,91.4 120 top
J52  87.47,88.02 300 top
J53  68.41,94.65 120 top
J54  12.62,87.9 60 top
J55  70.69,72.28 60 top
J56  33.82,80.17 120 top
J57  84.27,69.55 240 top
J58  86.07,72.59 240 top
J59  75.31,53.06 240 top
J60  76.92,55.95 240 top
J61  69.78,53.23 120 top
J62  68.14,56.15 120 top
J63  74.32,59.56 0 top
J64  70.8,59.59 0 top
J65  51.87,20.21 0 top
J66  54.37,17.21 240 top
J67  47.37,14.21 120 top
J68  45.87,17.21 120 top
J69  52.87,14.21 240 top
J70  48.37,20.21 0 top
J71  64.37,87.22 300 top
J72  66.15,84.23 300 top
J73  43.99,66.58 180 top
J74  30.36,53.21 240 top
J75  61.58,71.73 240 top
J76  59.96,68.78 240 top
J77  23.94,56.22 120 top
JP3  50.15,96.46 270 top
JP5  59.96,78.25 270 top
Q1  59.85,86.2 0 top
R1  64.26,78.24 0 top
R2  28.01,51.06 180 top
R3  46.27,69.99 180 top
R4  55.4,86.36 270 top
R5  47.36,68.22 0 top
R9  43.38,38.13 180 top
R10  53.46,55.17 270 top
R11  43.38,39.96 0 top
R12  57.75,41.31 90 top
R13  43.38,36.29 0 top
R15  72.59,50.78 180 top
R17  49.87,11.71 180 top
R29  60.88,49.23 90 top
S1  56.5,72.51 0 top
S2  61.53,92.67 300 top
U1  46.83,78.74 270 top
U2  53.18,89.53 270 top
U5  51,40.51 90 top
U6  50.8,34.08 0 top
U7  50.45,49.02 90 top
U$1  [BOTTOMSILK_NOLABELS_300DPI#PNG]  49.32,51.53 0 bottom
U$2  [TOPSILK_300DPI#01#PNG]  50.05,51.6 0 top
Y1  51.28,85.82 270 top

### Tracks (layer width: path | path; a pad name or v marks a point on that pad's centre or on a via)
3.3V  (via drill 0.51)
  Top 0.2: 50.28,73.79 50.28,75.39 50.16,75.51 49.59,75.51 | J70.P$1 48.37,18.21 48.57,18.01 | 48.57,18.01 48.87,17.71 D3.A 50.37,17.21 J66.P$1 | J68.P$1 47.77,17.21 48.57,18.01 | J17.P$1 45.39,58.68 44.97,59.11
  Top 0.254: 50.28,73.79 50.28,72.76 50.23,72.71 C1.1 50.23,71.09 v50.87,70.46 58.29,70.46 J76.P$1 arc39 61.57,68.01 62.47,67.41 | U2.5 56.09,90.49 C10.1 v56.37,89.21 | Q1.2 62.12,85.2 63.12,84.21 63.12,80.96 v63.99,80.08 65.11,78.97 R1.2 | U1.44 57.4,79.49 58.7,80.79 JP5.1 | 49.62,79.49 U1.17 42.55,79.46 C4.1 35.15,79.46 34.22,80.4 33.99,80.17 J56.P$1 31.26,78.41 29.76,77.11 J34.P$1 27.43,75.51 22.76,75.51 | 49.62,79.49 50.86,79.49 | 50.86,79.49 50.87,79.49 U1.44 | U1.44 50.86,79.49 | U1.36 49.59,75.51 49.62,79.49 | C24.1 77.37,91.45 77.87,90.95 D2.1 79.09,88.98 79.11,88.96 78.43,88.27 J47.P$1 | 83.12,78.46 C25.1 83.11,78.46 83.11,80.46 83.28,80.62 D5.1 85.27,80.18 v85.27,78.41 | J57.P$1 81.02,69.55 80.57,70 D6.1 79.09,68.48 79.11,68.46 78.76,68.1 C26.1 77.37,66.71 76.86,66.21 70.88,66.21 J7.P$1 arc-52 67.77,68.71 arc33 65.77,69.51 arc-26 65.46,69.61 arc137 64.27,68.71 arc-139 62.47,67.41 | U5.5 49.63,39.5 48.29,39.5 C14.1 47.98,40.46 v47.95,40.5 | R9.2 40.58,38.13 39.7,37.25 39.7,34 45.37,28.33 J28.P$1 arc-29 45.27,25.71 arc33 45.27,25.21 arc81 46.97,24.11 arc-95 48.27,23.01 J70.P$1 | U6.5 52.02,36.71 C18.2 54.6,36.75 v56.2,36.75 | 48.87,48.19 U7.8 49,47.46 | C15.1 45.26,51.21 | 45.26,51.21 v45.26,51.46 45.26,56.52 C11.1 45.39,56.98 J17.P$1 | 45.26,51.21 46.62,51.21 46.78,51.05 C8.1 47.61,49.95 47.62,49.96 47.87,49.71 47.87,47.71 48.12,47.46 49,47.46 | 49,47.46 49,46.81 C12.1 48.83,46.48 48.83,43.88 v47.95,43 | 53.5,54.28 R10.2 57.73,54.32 58.81,53.24 | 26.36,56.99 26.36,56.98 | J36.P$1 31.9,56.67 31.11,56.67 31.08,56.71 D4.A 26.65,56.71 26.36,56.99 | J77.P$1 24.7,56.99 26.35,56.99
  Top 0.254: 26.35,56.99 26.36,56.99 | 26.35,56.99 26.35,59.19 J20.P$1 26.3,59.27 26.3,60.01 26.35,61.08 | 70.01,57.47 70.8,58.26 J64.P$1 arc2 70.77,62.41 arc80 69.96,63.31 arc17 67.77,63.31 arc-13 61.97,63.11 arc-90 61.38,63.79 arc-72 62.3,64.87 62.57,65.61 arc46 62.47,67.41 | 70.01,57.47 68.69,56.15 J62.P$1 | 70.01,57.47 70.57,56.9 D1.A 75.97,56.9 76.52,56.35 76.52,56.18 76.75,55.96 J60.P$1 | J44.P$1 18.93,94.44 19.26,94.11 20.89,94.11 | 20.89,94.11 D31.1 | J25.P$1 29.74,96.68 C22.1 24.34,95.09 23.36,94.11 20.89,94.11 | 20.66,74.51 20.66,74.61 21.56,75.51 22.76,75.51 | 20.66,74.51 20.66,73.45 D33.1 | C23.1 22.7,75.44 22.76,75.51 | v14.92,86.66 14.96,86.71 15.06,86.71 15.27,86.5 D32.1 16.9,83.77 17.26,83.41 17.26,77.96 C21.1 17.09,76.98 19.56,74.51 20.66,74.51 | 26.35,61.08 | J45.P$1 9.06,75.21 arc44 8.46,74.71 arc49 8.37,73.21 arc17 13.67,63.71 arc69 16.46,62.81 arc-24 18.96,63.01 arc17 24.36,63.11 arc-111 26.35,61.08 | 44.97,59.11 arc35 45.37,62.11 arc89 44.66,62.61 arc-100 43.97,63.21 J73.P$1 43.99,67.47 44.73,68.22 45.18,68.22 | R29.2 60.83,50.13 60.83,51.23 58.81,53.24 | v51.37,51.46 57.02,51.46 58.81,53.24 | R5.1 45.18,68.22 | R3.2 45.18,69.75 45.18,68.22
  Bottom 0.254: v63.99,80.08 64.11,79.96 64.11,81.46 v56.37,89.21 53.12,92.46 43.12,92.46 40.62,89.96 40.62,86.96 J56.P$1 | J73.P$1 44.12,66.71 44.12,71.46 45.12,72.46 48.87,72.46 v50.87,70.46 | J52.P$1 85.77,88.02 | 85.77,88.02 72.41,88.02 J47.P$1 | 49.95,40.5 v47.95,40.5 | v47.95,43 v47.95,40.5 | v51.37,51.46 45.62,51.46 45.37,51.21 45.26,51.31 v45.26,51.46 45.26,45.57 43.31,43.61 43.31,41.9 45.96,39.25 | 45.96,39.25 45.45,38.73 45.45,36.71 | 45.96,39.25 47.23,40.52 47.25,40.5 v47.95,40.5 | 45.45,36.71 45.45,28.29 J28.P$1 | v56.2,36.75 45.48,36.75 45.45,36.71 | J45.P$1 12.42,84.16 v14.92,86.66 17.76,89.51 17.76,93.71 17.03,94.44 J44.P$1 | 85.77,88.02 85.77,78.91 v85.27,78.41 84.27,77.41 J57.P$1
!RESET
  Top 0.254: S1.4 54.57,73.31 | 54.57,73.31 S1.3 58.66,73.21 59.62,73.21 60.62,74.21 60.6,74.22 JP5.10 61.12,75.71 61.62,76.21 61.62,77.46 62.4,78.24 R1.1 | U1.40 52.58,77.49 54.47,75.61 54.47,73.41 54.57,73.31
A3  (via drill 0.51)
  Top 0.254: U1.9 v45.62,80.96 | U5.1 v54.2,39.56 55.51,39.56 55.7,39.75 55.7,40.47 C17.2 | 42.62,36.19 R13.1 42.52,35.38 42.78,35.12 v47.39,35.12 | J37.P$1 62.77,57.11 arc111 62.87,58.41 62.16,59.68 arc57 60.64,61.96 arc32 58.95,62.31 arc-75 56.66,63.83 arc-37 56.66,64.06 56.68,64.06 J10.P$1
  Bottom 0.254: v45.62,80.96 45.62,76.21 47.37,74.46 51.62,74.46 56.87,69.21 56.87,67.05 56.68,66.86 J10.P$1 | 54.63,39.56 v54.2,39.56 56.44,39.56 56.99,39.01 | 56.99,39.01 57.87,38.14 57.87,36.39 56.59,35.12 v47.39,35.12 | J37.P$1 60.45,55.63 60.45,42.46 56.99,39.01
D2  (via drill 0.51)
  Top 0.254: U1.23 40.15,76.49 40.12,76.46 v37.87,76.46 | D2.4 73.94,91.63 70.61,94.96 68.71,94.96 J53.P$1 | v80.36,86.51 v80.36,89.21
  Bottom 0.254: v37.87,76.46 41.62,76.46 42.62,77.46 42.62,88.46 45.87,91.71 49.12,91.71 50.12,90.71 50.12,77.71 53.37,74.46 63.06,74.46 J14.P$1 64.13,73.91 64.77,73.91 arc-53 65.16,73.71 65.96,73.31 arc74 67.06,73.51 arc38 68.27,76.21 arc-125 69.96,76.91 J42.P$1 79.27,82.28 79.27,84.71 80.66,86.11 80.36,86.41 v80.36,86.51 | v80.36,89.21 74.92,94.65 J53.P$1
D3
  Top 0.254: J23.P$1 34.88,84.19 38.08,80.99 U1.14
D5  (via drill 0.51)
  Top 0.254: U1.24 42.55,75.96 41.12,75.96 40.87,75.71 v40.87,75.21
  Bottom 0.254: v40.87,75.21 40.87,73.68 39.12,71.94 39.12,71.77 J3.P$1
D6
  Top 0.254: J18.P$1 37.38,74.71 38.62,74.71 40.57,72.76 45.17,72.76 46.03,73.61 46.03,74.44 U1.29
D7  (via drill 0.51)
  Top 0.2: J5.P$1 40.87,69.21 41.12,69.46
  Top 0.254: U7.2 49.97,52.31 50.37,52.71 52.14,52.71 | 52.14,52.71 v52.62,52.71 | J5.P$1 37.77,67.41 arc89 37.57,66.81 arc6 39.87,62.71 arc-108 39.66,62.21 arc54 38.87,61.51 38.16,59.11 arc-35 37.57,58.21 arc118 37.66,57.51 arc-45 38.66,56.51 arc84 J40.P$1 | R10.1 52.41,56.02 52.12,55.74 52.12,52.72 52.14,52.71 | U1.30 46.58,73.42 45.4,72.24 43.9,72.24 40.87,69.21
  Bottom 0.254: J40.P$1 43.37,52.71 v52.62,52.71
D8
  Top 0.254: U1.11 44.58,86.42 J8.P$1
D9
  Top 0.254: U1.12 44.08,84.24 38.67,89.65 J9.P$1 34.77,91.01 arc63 33.97,91.01 31.36,87.11 arc-65 30.49,86.72 29.65,87.25 arc57 J32.P$1 25.96,88.21 23.56,90.61 23.56,92.91 24.79,94.13 D31.4
  Bottom 0.254: J32.P$1 22.86,84.31 22.86,80.81 24.66,79.01 24.66,77.11 26.31,75.46 | 26.31,75.46 26.36,75.41 | J26.P$1 29.72,69.65 26.31,73.06 26.31,75.46
DO
  Top 0.254: J54.P$1 12.62,79.95 18.26,74.31 18.26,70 | D33.2 18.26,70 | 18.26,70 17.47,70 | 17.47,70 17.46,70.01 | J41.P$1 16.89,70 17.47,70
DOUT
  Top 0.254: J48.P$1 83.9,88.18 87.11,84.96 87.11,77.46 | J50.P$1 87.11,76.47 87.11,77.46 | D6.2 83.35,77.46 87.11,77.46
GND  (via drill 0.38, 0.51)  (1 unrouted)
  Top 0.2: U1.35 49.08,73.32 48.66,72.91
  Top 0.254: J11.P$1 47.16,63.11 arc89 47.77,62.51 arc-89 48.57,61.71 J19.P$1 | J63.P$1 74.36,62.81 | J61.P$1 67.86,52.01 arc-12 67.06,51.61 | J65.P$1 51.77,23.41 arc103 50.57,24.31 arc-77 48.57,25.21 J29.P$1 | J6.P$1 33.47,75.81 32.66,75.31 | v25.96,101.41 26.06,98.71 v26.16,98.01
  Bottom 0.254: J58.P$1 86.68,72.59 89.16,70.11 89.96,70.11 | J4.P$1 29.86,62.91 29.96,63.01 | J74.P$1 31.16,52.41 31.96,52.41 33.47,51.41
  other vias: 51.12,46.83 40.64,50.32 39.53,46.51 38.26,48.1 37.7,41.95 39.61,39.56 68.1,58.42 76.99,58.74 74.61,55.24 70.8,55.72 32.7,59.21 23.18,58.9 26.35,55.56 12.88,68.1 27.88,67.3 22.78,78 16.28,74 19.78,67.7 38.78,52.4 41.78,62.9 78.88,66.3 68.98,66.3 47.67,54.97 42.98,49.55 57.26,32.09 61.43,36.56 60.08,30.8 70.58,38.6 95.38,78.1 76.68,84.5 68.38,103.2 75.18,103.2 90.08,93.9 92.48,89.1 36.38,102.4 29.78,103.1 22.08,103.2 11.18,69.9 34.08,82.3 36.48,80.6 40.88,70.8 53.18,68.7 58.38,67.8 38.88,90.5 56.08,62.5 52.68,62.6 46.01,42.7 35.02,40.06 37.6,34.65 40,30.95 47.42,31.96 49.22,30.66 34.22,29.86 33.32,33.36 30.12,35.26 29.82,39.36 25.62,42.96 21.82,48.36 16.32,59.16 71.38,68.9 77.68,77 81.68,72.4 89.78,79.5 87.88,65.6 83.78,59.6 56.68,75.7 56.68,80.5 45.72,19.96 58.76,51.65 42.68,69.24 54.32,84.63
  pour Top: 13.02,104.77 86.84,104.77 99.85,82.23 50.01,0 0,82.23
  pour Bottom: 0.16,82.23 13.02,104.77 86.68,104.77 86.84,104.77 99.85,82.23 50.01,0
LEDA
  Top 0.254: U7.5 51.93,48.31 51.93,47.37 52.43,46.87 53.34,46.87 | R29.1 60.95,48.31 60.95,47.25 60.57,46.87 59.37,46.87 | 53.34,46.87 54.82,46.87 | 54.82,46.87 56.37,46.87 | 56.37,46.87 57.91,46.87 | 57.91,46.87 59.37,46.87 | C28.1 59.37,46.87 | C27.1 57.89,46.9 57.91,46.87 | C16.1 56.39,46.89 56.37,46.87 | C13.1 54.87,46.92 54.82,46.87 | C29.1 53.39,46.92 53.34,46.87
N$1
  Top 0.254: D4.C 28.11,52.88 27.16,51.93 R2.2
N$2
  Top 0.254: U1.1 49.58,83.67 50.48,84.57 Y1.P$2 51.67,84.96 52.91,84.96 C5.2
N$3
  Top 0.254: C19.1 59.84,39.14 58.95,38.25 49.7,38.25 49.45,38 49.45,36.86 U6.1
N$4
  Top 0.254: U1.2 49.08,84.42 49.17,84.52 C6.1 49.5,85.71 50.87,85.71 51.28,86.12 Y1.P$1
N$5
  Top 0.254: U7.4 U7.3
N$6
  Top 0.254: U5.4 48.7,41.46 | 48.7,41.46 46.66,41.46 46.2,41 46.2,36.5 45.95,36.25 44.27,36.25 R13.2 | R12.1 56.98,40.46 56.7,40.75 56.7,42 56.49,42.21 C17.1 54.74,42.21 54.45,42.5 48.95,42.5 48.7,42.25 48.7,41.46
N$10
  Top 0.254: C19.2 R12.2
N$11  (via drill 0.51)
  Top 0.254: 45.45,40 45.45,38.5 45.08,38.13 R9.1 | 45.45,40 45.45,41.5 45.14,41.8 C20.1 44.2,41.83 v44.2,43.25 | R11.2 45.41,39.97 45.45,40 | U5.3 53.48,41.46 v53.95,41
  Bottom 0.254: v53.95,41 53.95,43.25 53.2,44 44.95,44 v44.2,43.25
N$12
  Top 0.254: D1.C 71.73,53.08 R15.2
N$14
  Top 0.254: D31.2 20.92,84.26 D32.4
N$15
  Top 0.2: D3.C 49.77,14.61 49.77,13.31 49.02,12.56 R17.2
N$16  (via drill 0.51)
  Top 0.254: D32.2 13.96,81.88 v13.96,82.21 13.96,82.31 | v23.96,73.21 26.06,73.21 D33.4
  Bottom 0.254: v13.96,82.21 23.06,73.11 23.86,73.11 v23.96,73.21
N$21
  Top 0.254: S2.3 61.14,88.44 62.35,87.22 J71.P$1
N$22
  Top 0.254: D2.2 80.67,94.15 81.86,92.96 81.86,80.96 81.53,80.62 D5.4
N$23  (via drill 0.51)
  Top 0.254: D5.2 83.75,83.82 83.11,84.46 v83.11,86.21 | v75.86,69.96 75.82,70 D6.4
  Bottom 0.254: v83.11,86.21 83.11,77.21 v75.86,69.96
SCL  (via drill 0.51)
  Top 0.25: U1.32 47.58,71.74
  Top 0.254: U7.7 50.05,48.24 50.05,46.12 51.12,45.05 62.18,45.05 63.98,46.85 v63.98,48.58 63.49,48.58 61.78,50.29 61.78,51.03 58.06,54.75 57.32,54.75 55.12,56.96 55.12,58.3 J15.P$1 arc-92 54.97,60.11 arc95 54.97,60.31 54.97,61.25 arc-43 53.5,63.99 53.54,64.02 J38.P$1 50.52,69.59 48.36,69.59 | 47.58,71.74 47.58,71.7 48.36,70.93 48.36,69.59 | 48.36,69.59 48.36,68.37 R5.2
  Bottom 0.254: J13.P$1 63.98,37.22 v63.98,48.58
SDA  (via drill 0.38, 0.51)
  Top 0.254: U7.1 49,54.09 51.76,56.85 J16.P$1 arc27 51.77,61.11 arc-27 51.77,61.71 arc102 51.07,62.61 arc-88 50.37,63.31 arc-1 J12.P$1 | v62.23,52.23 61.59,52.23 57.47,56.36 v57.63,56.36 | U1.31 47.08,71.26 | 47.08,71.26 47.08,70.02 R3.1 | v45.88,71.29 47.05,71.29 47.08,71.26
  Bottom 0.254: J39.P$1 51.77,29.18 62.79,40.2 62.79,51.67 v62.23,52.23 | v57.63,56.36 52.71,56.36 51.75,57.31 51.75,58.52 J16.P$1 | J12.P$1 50.34,66.82 v45.87,71.29 | 45.8,71.35 v45.87,71.29 | v45.87,71.29 v45.88,71.29
SWCLK  (via drill 0.51)
  Top 0.2: U1.45 54.4,79.99 54.41,80
  Top 0.254: v54.62,81.57 54.62,80.21 54.41,80
  Bottom 0.254: JP5.4 61.68,79.52 61.87,79.71 61.87,81.71 61.37,82.21 57.87,82.21 57.37,81.71 54.62,81.71 v54.62,81.57
SWDIO
  Top 0.2: U1.46 51.94,80.49 52.16,80.71
  Top 0.254: JP5.2 62.2,80.79 62.37,80.96 62.37,83.21 61.87,83.71 58.83,83.71 58.83,83.7 55.66,83.7 55.65,83.71 52.62,83.71 52.12,83.21 52.12,81.81 52.16,81.77 52.16,80.71
USB_D+  (via drill 0.51)
  Top 0.254: JP3.D+1 50.15,91.74 v48.37,89.96 | v48.62,76.96 48.62,75.38 48.61,75.38 48.61,74.52 U1.34
  Bottom 0.254: v48.37,89.96 48.37,77.21 v48.62,76.96
USB_D-  (via drill 0.51)
  Top 0.254: U1.33 48.08,75.99 46.87,77.21 v46.87,77.71 | v46.87,88.96 49.62,88.96 50.8,90.14 JP3.D-1
  Bottom 0.254: v46.87,77.71 v46.87,88.96
VBUS
  Top 0.254: Q1.1 58.9,84.49 58.62,84.21 55.87,84.21 55.4,84.67 R4.2 54.56,85.51 54.12,85.96 54.12,87.21 52.87,88.46 52.87,88.71 | JP3.VBUS1 51.45,92.49 C7.1 51.86,90.51 U2.1 52.59,90.49 52.87,90.21 52.87,88.71 | U2.3 52.74,88.59 52.87,88.71
VDDANA
  Top 0.254: U1.6 47.08,85.26 C3.1
VDDCORE  (via drill 0.51)
  Top 0.2: U1.43 55.86,78.99 v56.75,78.1
  Top 0.254: U1.43 51.11,78.96 | C2.1 56.87,82.71 56.62,82.46 v53.12,82.46
  Bottom 0.254: v53.12,82.46 53.12,81.73 v56.75,78.1
VIN
  Top 0.254: S2.2 59.35,92.44 58.37,91.46 58.37,87.21 | 58.37,87.21 59.76,87.21 Q1.3 | 58.37,87.21 C9.1

### Text on the board
tPlace: https://creativecommons.org/licenses/by-nc-sa/4.0/legalcode / / This license lets others remix, tweak, and build upon your work / non-commercially, and although their new works must also / acknowledge you and be non-commercial, they don’t have to / license their derivative works on the same terms.